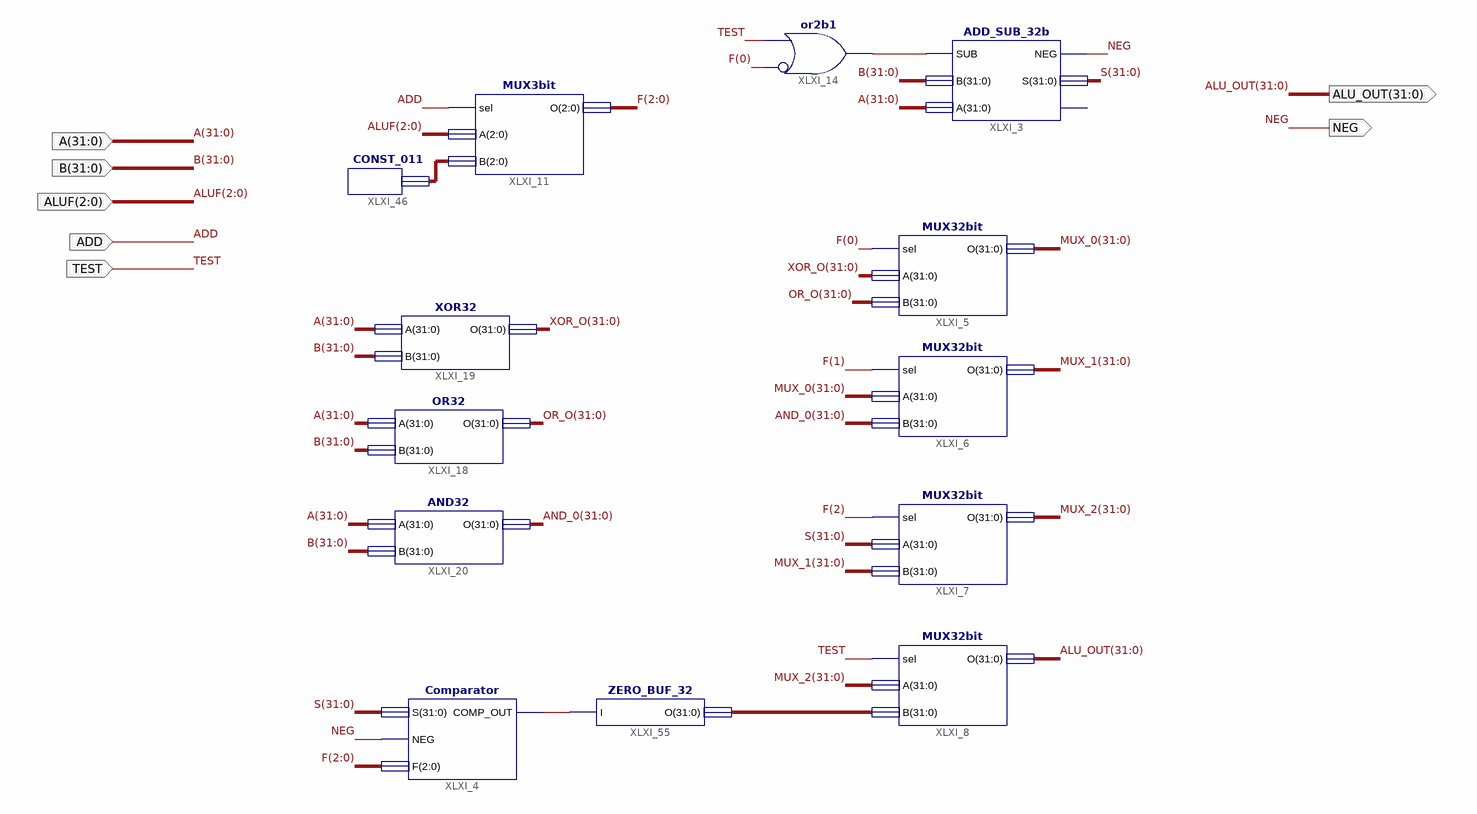
[diagram p0: schematic sheet 1]
// Xilinx ISE schematic ALU_ENV.sch (spartan6) as structural Verilog: 13 symbols, 7 ports
module ALU_ENV (
  input  ADD,
  input  [2:0] ALUF,
  input  TEST,
  input  [31:0] A,
  input  [31:0] B,
  output NEG,
  output [31:0] ALU_OUT
);

  wire XLXN_39, XLXN_217;
  wire [2:0] F, XLXN_394;
  wire [31:0] AND_0, MUX_0, MUX_1, MUX_2, OR_O, S, XLXN_33, XOR_O;

  ZERO_BUF_32 XLXI_55 (.I(XLXN_217), .O(XLXN_33));
  MUX32bit XLXI_7 (.sel(F[2]), .A(S), .B(MUX_1), .O(MUX_2));
  MUX32bit XLXI_6 (.sel(F[1]), .A(MUX_0), .B(AND_0), .O(MUX_1));
  MUX32bit XLXI_5 (.sel(F[0]), .A(XOR_O), .B(OR_O), .O(MUX_0));
  MUX32bit XLXI_8 (.sel(TEST), .A(MUX_2), .B(XLXN_33), .O(ALU_OUT));
  Comparator XLXI_4 (.S(S), .NEG(NEG), .F(F), .COMP_OUT(XLXN_217));
  or XLXI_14 (XLXN_39, ~F[0], TEST);  // or2b1
  ADD_SUB_32b XLXI_3 (.SUB(XLXN_39), .B(B), .A(A), .NEG(NEG), .S(S));  // open: OVF
  OR32 XLXI_18 (.A(A), .B(B), .O(OR_O));
  AND32 XLXI_20 (.A(A), .B(B), .O(AND_0));
  XOR32 XLXI_19 (.A(A), .B(B), .O(XOR_O));
  MUX3bit XLXI_11 (.sel(ADD), .A(ALUF), .B(XLXN_394), .O(F));
  CONST_011 XLXI_46 (.O(XLXN_394));
endmodule
